# EAGLE schematic car_pcb1 (EAGLE 9.6.2)
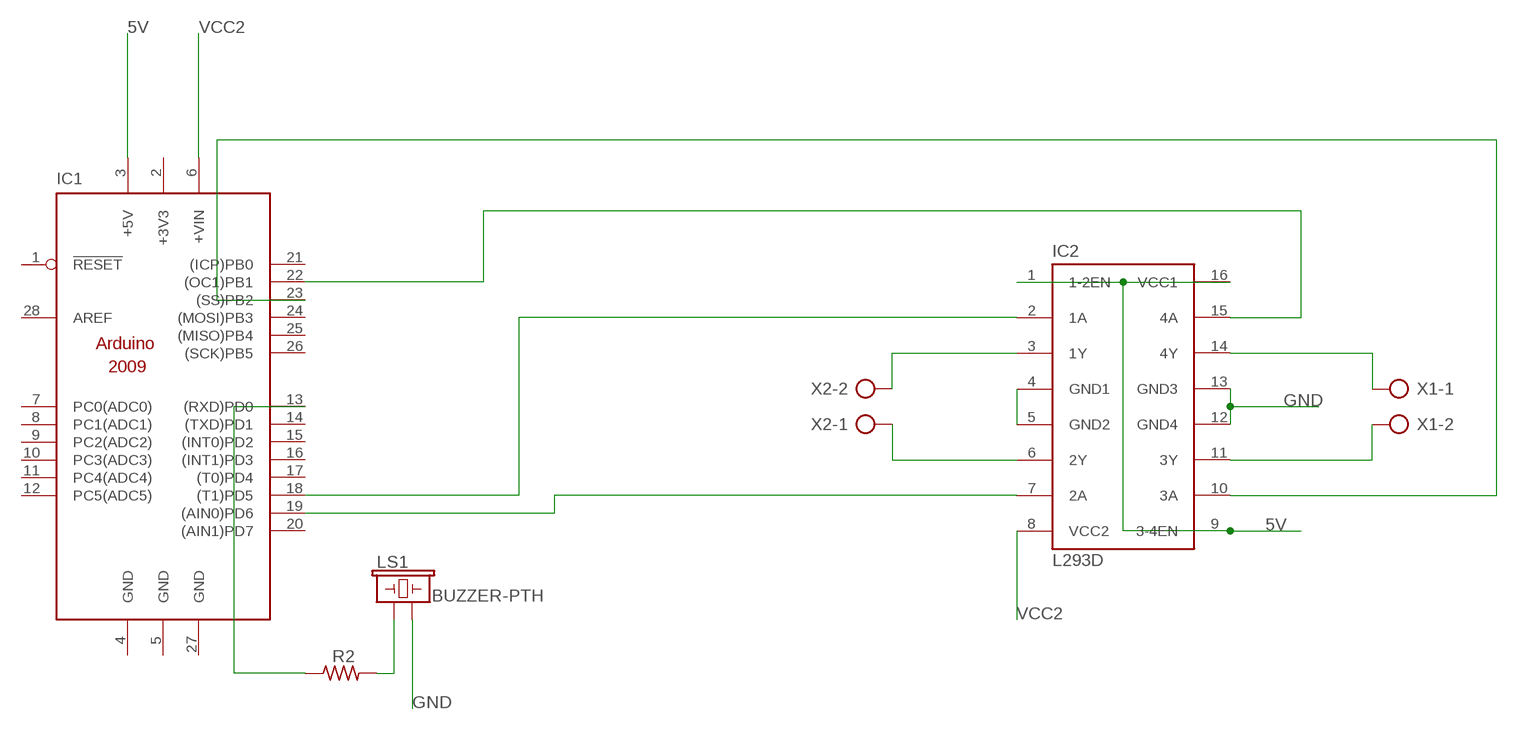
[diagram p0: schematic, sheet 1]

## Parts
IC1  ARDUINO2009_PIN_10  [ARDUINO2009]
IC2  L293D  [DIL16]
LS1  BUZZER-PTH  [BUZZER-12MM]
R2  R-US_0204/7  [0204/7]
X1  AK500/2  [AK500/2]
X2  AK500/2  [AK500/2]

## Nets
5V: IC1.3(+5V) IC2.1(1-2EN) IC2.9(3-4EN) IC2.16(VCC1)
GND: IC2.12(GND4) IC2.13(GND3) LS1.-
N$1: IC1.18((T1)PD5) IC2.2(1A)
N$2: IC1.19((AIN0)PD6) IC2.7(2A)
N$3: IC2.3(1Y) X2.2
N$4: IC2.6(2Y) X2.1
N$5: IC2.14(4Y) X1.1
N$6: IC2.11(3Y) X1.2
N$7: IC2.4(GND1) IC2.5(GND2)
N$8: IC1.22((OC1)PB1) IC2.15(4A)
N$9: IC1.23((SS)PB2) IC2.10(3A)
N$10: LS1.+ R2.2
N$11: IC1.13((RXD)PD0) R2.1
VCC2: IC1.6(+VIN) IC2.8(VCC2)
Unconnected: IC1.1(!RESET) IC1.7(PC0(ADC0)) IC1.8(PC1(ADC1)) IC1.9(PC2(ADC2)) IC1.10(PC3(ADC3)) IC1.11(PC4(ADC4)) IC1.12(PC5(ADC5)) IC1.14((TXD)PD1) IC1.15((INT0)PD2) IC1.16((INT1)PD3) IC1.17((T0)PD4) IC1.20((AIN1)PD7) IC1.21((ICP)PB0) IC1.24((MOSI)PB3) IC1.25((MISO)PB4) IC1.26((SCK)PB5) IC1.28(AREF)

## Power pins joined to a net without a drawn wire
+3V3: IC1.2(+3V3)
GND: IC1.4(GND) IC1.5(GND) IC1.27(GND)

## Library data of the parts
IC1 = arduino:ARDUINO2009_PIN_1: The Arduino Duemilanove ("2009") is a microcontroller board based on the ATmega168 or ATmega328. - 14 digital input/output pins (of which 6 can be used as PWM outputs) - 6 analog inputs, a 16 MHz crystal oscillator - USB connection - power jack - ISP header - reset button It contains everything needed to support the microcontroller; simply connect it to a computer with a USB cable or power it with a AC-to-DC adapter or battery to get started http://arduino.cc/en/Main/ArduinoBoardDuemilanove
IC2 = st-microelectronics:L293D: PUSH-PULL 4 CHANNEL DRIVER; MPN: L293D; OC_FARNELL: 9589619; OC_NEWARK: 56P8249
LS1 = SparkFun-Electromechanical:BUZZER: Buzzer Small round buzzers that operate around the audible 2kHz range. You can use these as speakers to create simple music or user interfaces. Variant Overview: PTH - Mini Speaker - PC Mount 12mm 2.048kHz <https://www.sparkfun.com/products/7950> PTH_KIT - Mini Speaker - PC Mount 12mm 2.048kHz <https://www.sparkfun.com/products/7950> KIT simplifies soldering by adding stop mask to one side of the pads. PTH_NO_SILK - Mini Speaker - PC Mount 12mm 2.048kHz <https://www.sparkfun.com/products/7950> No silkscreen indicator of buzzer outline. PTH_KIT_NO_SILK - Mini Speaker - PC Mount 12mm 2.048kHz <https://www.sparkfun.com/products/7950> KIT package w/o silkscreen SMD - Buzzer Audio Magnetic (CCV-084B16) SMD buzzer used on, e.g. the LilyPad Buzzer <https://www.sparkfun.com/products/8463> and RFID USB Reader <https://www.sparkfun.com/products/9963>. SMD_KIT - Buzzer Audio Magnetic (CCV-084B16) SMD Buzzer with elongated pins to make soldering easier. Used on the SparkFun Simon Says - Surface Mount Soldering Kit <https://www.sparkfun.com/products/10935>.; PROD_ID: COMP-08253; SF_SKU: COM-07950
R2 = rcl:R-US_: RESISTOR, American symbol; SPICEPREFIX: R
X1 X2 = con-ptr500:AK500/2: CONNECTOR; OC_FARNELL: unknown; OC_NEWARK: unknown